# Altium schematic sheet Photodiode_Sun_Sensor.SchDoc: Photodiode_Sun_Sensor
size Letter; Author: Nicholas J. Sorensen, and Erik F. Halliwell; Engineer: Nicholas J. Sorensen, and Erik F. Halliwell; DocumentNumber: 4; SheetNumber: 4; SheetTotal: 8
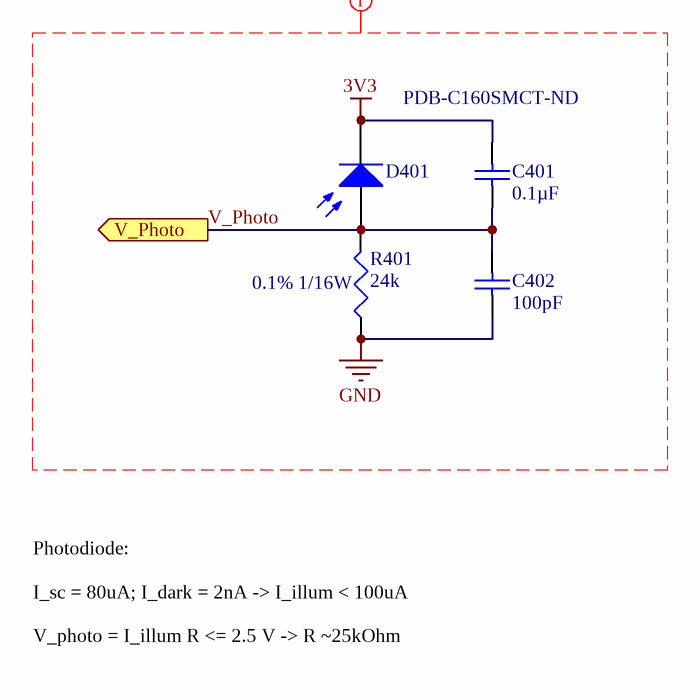
[diagram p0: Photodiode_Sun_Sensor.SchDoc]

## Parts
C401  value 0.1µF  [TDK-CGA2B]  (hidden comment: Cap)
C402  value 100pF  [TDK-CGA2B]  (hidden comment: Cap)
D401  PDB-C160SMCT-ND  [PDB-C160SM]
R401  0.1% 1/16W  value 24k  [PANA-ERA2A]

## Ports
V_Photo (out)

## Nets
3V3: C401.2 D401.2(K)
GND: C402.1 R401.1
V_Photo: C401.1 C402.2 D401.1(A) R401.2 ; port V_Photo

## Layout directives
mark named Photodiode Sun Sensors: 3V3, GND, V_Photo

## Notes on the sheet
- Photodiode:
  I_sc = 80uA; I_dark = 2nA -> I_illum < 100uA
  V_photo = I_illum R <= 2.5 V -> R ~25kOhm
- (the "License"); you may not use or redistribute this file except in compliance with the License. You
- This file and the information within it are licensed under the terms of the Apache License, Version 2.0
- Copyright
- Unless required by applicable law or agreed to in writing, content distributed under the License is
- distributed on an "AS IS" BASIS, WITHOUT WARRANTIES OR CONDITIONS OF ANY KIND,
- either express or implied. See the License for the specific language governing permissions and
- limitations under the License.
- may obtain a copy of the License at:
- http://www.apache.org/licenses/LICENSE-2.0
- Title
- Size:
- Date:
- Letter
- Number:
- Time:
- Revision:
- Sheet
- of
- University of Alberta
- Deptartment of Electrical
- and Computer Engineering
- Edmonton AB, Canada
- T6G 1H9
- File:

## Library data of the parts
C401 = PC-TDK-02259: CAP CER 0.1UF 50V X7R 0402; Manufacturer Part Number: CGA2B3X7R1H104K050BB; Index: 2259; Tolerance: ±10%; Published: 2016-03-16; LatestRevisionDate: 2016-03-16; LatestRevisionNote: ...; PackageReference: 0402 (1005 Metric); Publisher: AlbertaSat; PackageDescription: Radial Cap, Thru-Hole; 2 Leads; 0.3 in Pin Spacing; Part Number: PC-TDK-02259; Supplier Part Number 1: 445-6899-1-ND; Supplier 1: Digi-key; Supplier Link: http://www.digikey.ca/product-search/en?keywords=445-6899-1-ND; Voltage - Rated: 50V; Temperature Coefficient: X7R; Applications: Automotive
C402 = PC-TDK-01227: CAP CER 100PF 50V C0G 0402; Manufacturer Part Number: CGA2B2C0G1H101J050BA; Index: 1227; Tolerance: ±5%; Temperature Coefficient: NP0; Published: 2016-03-16; LatestRevisionDate: 2016-03-16; LatestRevisionNote: ...; PackageReference: 0402 (1005 Metric); Publisher: AlbertaSat; PackageDescription: Radial Cap, Thru-Hole; 2 Leads; 0.3 in Pin Spacing; Part Number: PC-TDK-01227; Supplier Part Number 1: 445-5596-1-ND; Supplier 1: Digi-key; Supplier Link: http://www.digikey.ca/product-search/en?keywords=445-5596-1-ND; Voltage - Rated: 50V; Applications: Automotive
D401 = PXX-ADP-00000: SENSOR PHOTODIODE 850NM 2SMD GW; Manufacturer Part Number: Advanced Photonics; Index: 1; Designator: D?; Published: 3/28/2020; LatestRevisionDate: 3/28/2020; LatestRevisionNote: ...; PackageReference: PIN2; Publisher: AlbertaSat; Part Number: PXX-ADP-00000; Supplier Part Number 1: PDB-C160SMCT-ND; Supplier 1: Digi-key
R401 = 17830: RES SMD 24K OHM 0.1% 1/16W 0402; Part Number: 17830; Manufacturer Part Number: ERA-2APB243X; Designator: R?; Power: 0.063W, 1/16W; Temperature Coefficient: ±15ppm/°C; Published: 8-Jun-2000; LatestRevisionDate: 29-May-2009; LatestRevisionNote: IPC-7351 Footprint Added.; PackageReference: 0402 (1005 Metric); Publisher: Altium Limited; PackageDescription: Chip Resistor, 2-Leads, Body 1.00x0.50mm, IPC Low Density; Supplier Part Number 1: P24KCNCT-ND; Supplier 1: Digi-Key; Supplier Link: http://www.digikey.ca/product-search/en?keywords=P24KCNCT-ND; Tolerance: ±0.1%